# EAGLE design schematicmrpRevG (EAGLE 7.5.0)
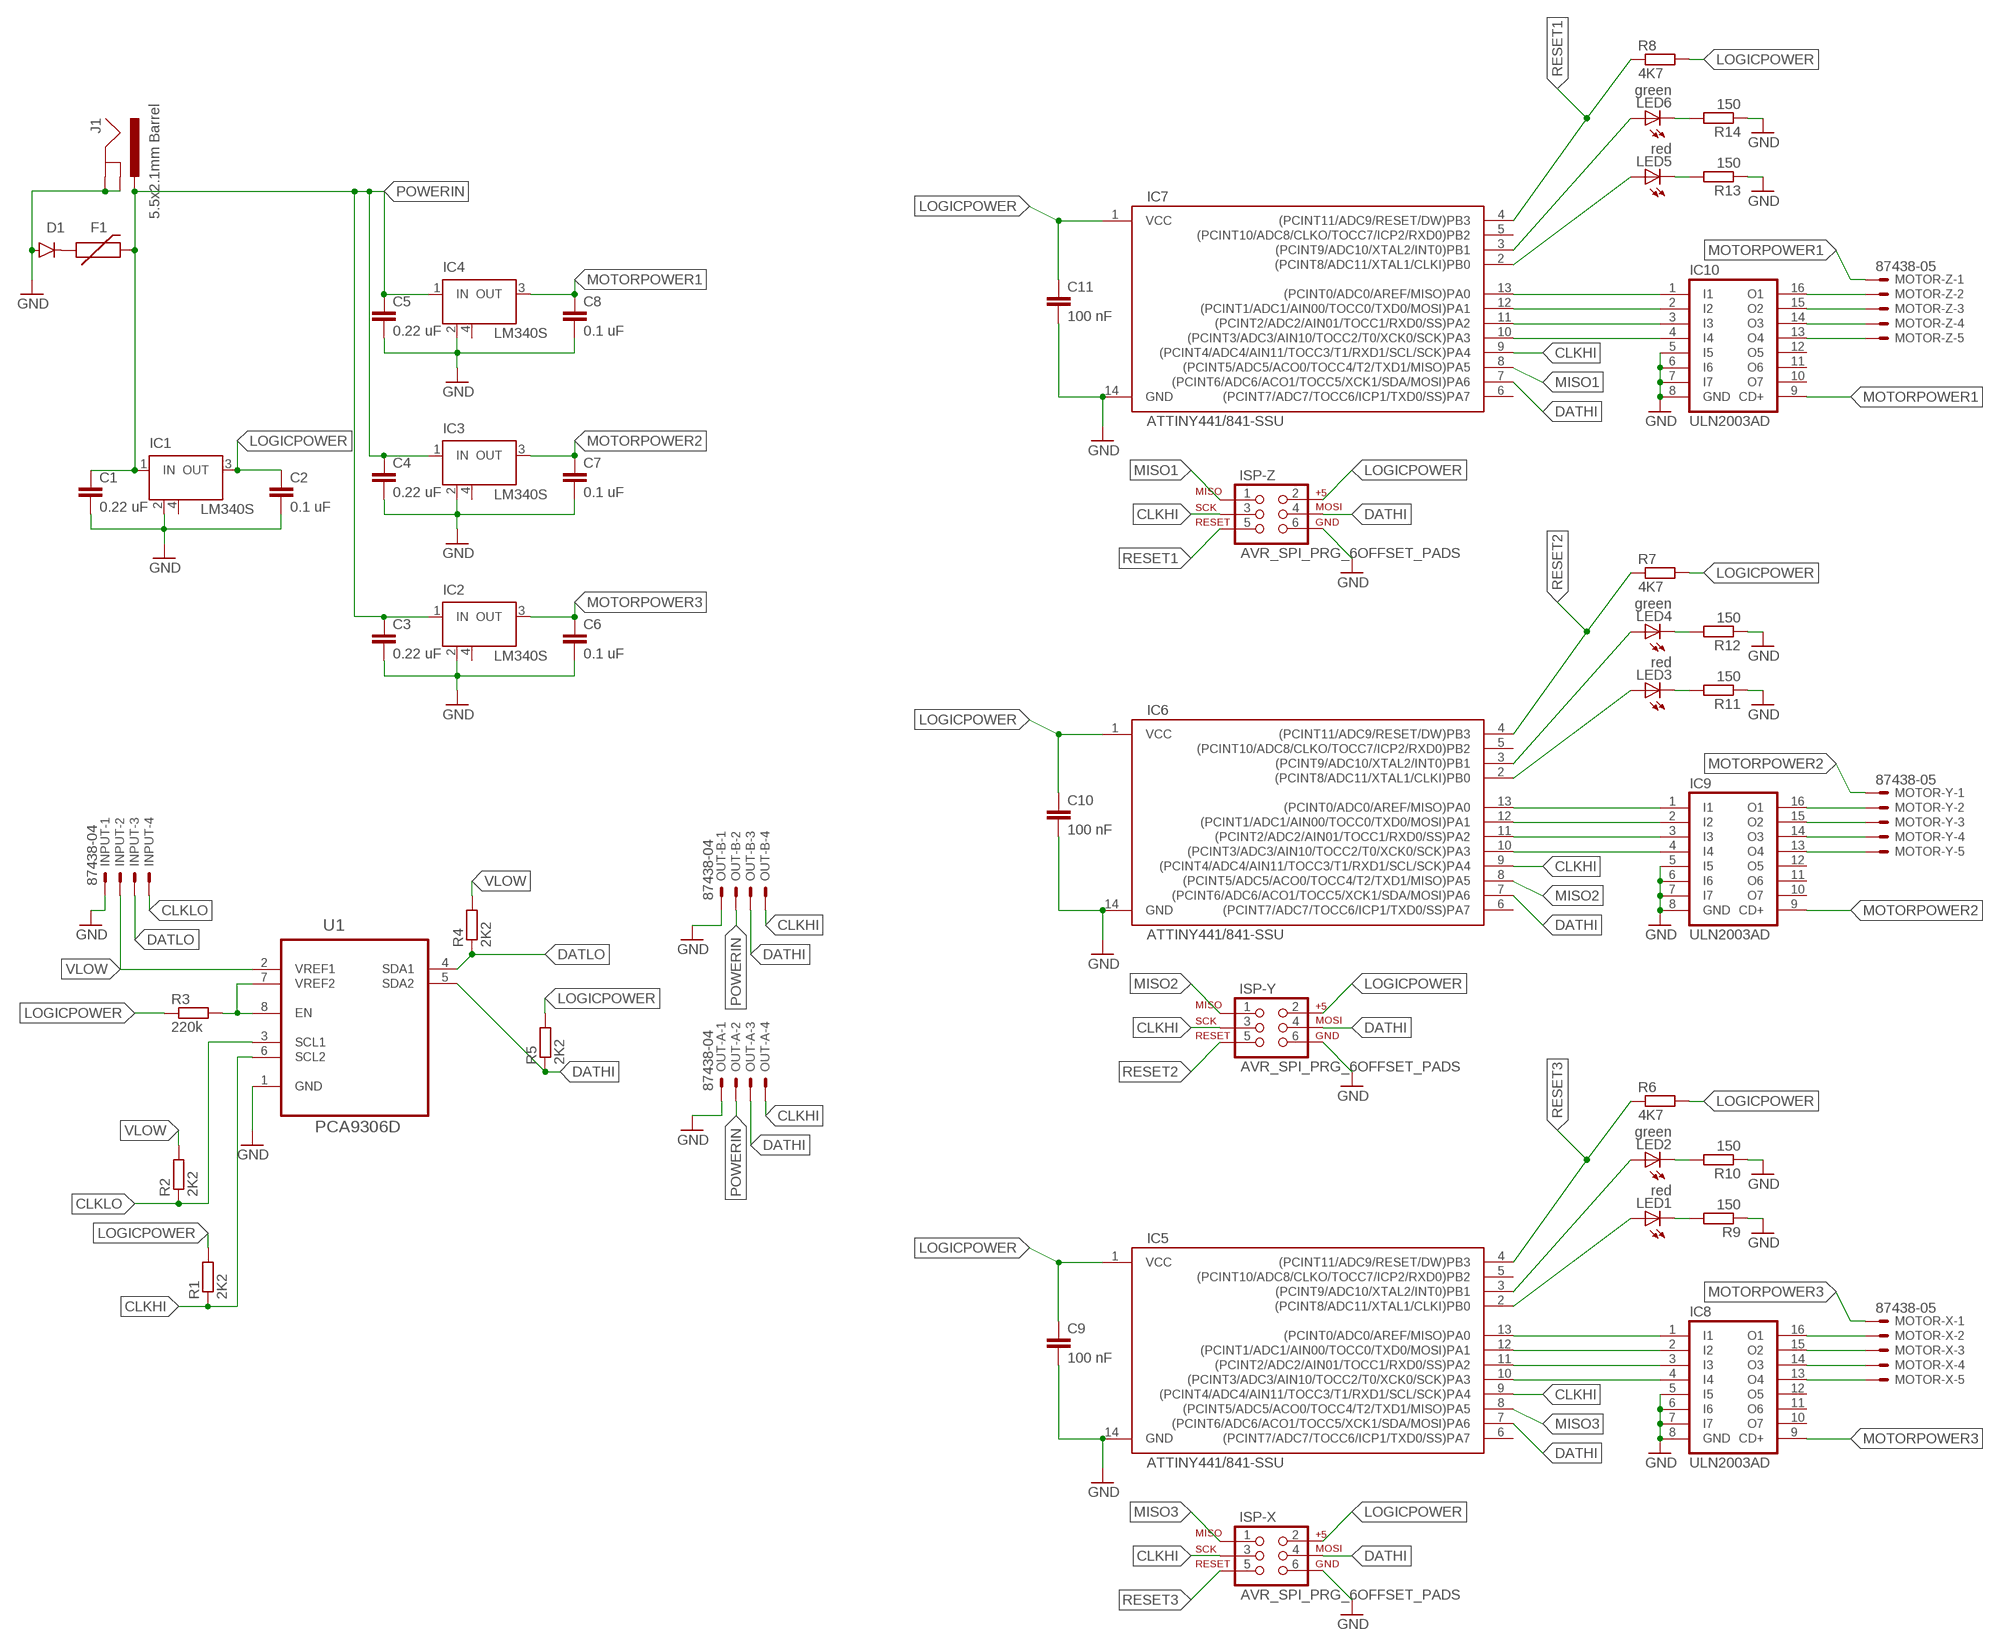
[diagram p0: schematic, sheet 1]

## Parts
C1  0.22 uF  CAP0805  [0805]
C2  0.1 uF  CAP0805  [0805]
C3  0.22 uF  CAP0805  [0805]
C4  0.22 uF  CAP0805  [0805]
C5  0.22 uF  CAP0805  [0805]
C6  0.1 uF  CAP0805  [0805]
C7  0.1 uF  CAP0805  [0805]
C8  0.1 uF  CAP0805  [0805]
C9  100 nF  CAP0805  [0805]
C10  100 nF  CAP0805  [0805]
C11  100 nF  CAP0805  [0805]
D1  3A/600V  DIODESMA-KIT  [SMA-DIODE-KIT]
F1  PTCSMD  [PTC-1206]
IC1  LM340S  [SOT223]
IC2  LM340S  [SOT223]
IC3  LM340S  [SOT223]
IC4  LM340S  [SOT223]
IC5  ATTINY441/841-SSU  [SOIC14N]
IC6  ATTINY441/841-SSU  [SOIC14N]
IC7  ATTINY441/841-SSU  [SOIC14N]
IC8  ULN2003AD  [SO16]
IC9  ULN2003AD  [SO16]
IC10  ULN2003AD  [SO16]
INPUT  87438-04  [87438-04]
ISP-X  AVR_SPI_PRG_6OFFSET_PADS  [2X3_OFFSET]
ISP-Y  AVR_SPI_PRG_6OFFSET_PADS  [2X3_OFFSET]
ISP-Z  AVR_SPI_PRG_6OFFSET_PADS  [2X3_OFFSET]
J1  5.5x2.1mm Barrel  POWER_JACKSMD  [POWER_JACK_SMD]
LED1  red  LEDCHIPLED_0805  [CHIPLED_0805]
LED2  green  LEDCHIPLED_0805  [CHIPLED_0805]
LED3  red  LEDCHIPLED_0805  [CHIPLED_0805]
LED4  green  LEDCHIPLED_0805  [CHIPLED_0805]
LED5  red  LEDCHIPLED_0805  [CHIPLED_0805]
LED6  green  LEDCHIPLED_0805  [CHIPLED_0805]
MOTOR-X  87438-05  [87438-05]
MOTOR-Y  87438-05  [87438-05]
MOTOR-Z  87438-05  [87438-05]
OUT-A  87438-04  [87438-04]
OUT-B  87438-04  [87438-04]
R1  2K2  R-EU_M0805  [M0805]
R2  2K2  R-EU_M0805  [M0805]
R3  220k  R-EU_M0805  [M0805]
R4  2K2  R-EU_M0805  [M0805]
R5  2K2  R-EU_M0805  [M0805]
R6  4K7  R-EU_M0805  [M0805]
R7  4K7  R-EU_M0805  [M0805]
R8  4K7  R-EU_M0805  [M0805]
R9  150  R-EU_M0805  [M0805]
R10  150  R-EU_M0805  [M0805]
R11  150  R-EU_M0805  [M0805]
R12  150  R-EU_M0805  [M0805]
R13  150  R-EU_M0805  [M0805]
R14  150  R-EU_M0805  [M0805]
U1  PCA9306D  [SOIC127P600X175-8N]

## Nets
CLKHI: IC5.9((PCINT4/ADC4/AIN11/TOCC3/T1/RXD1/SCL/SCK)PA4) IC6.9((PCINT4/ADC4/AIN11/TOCC3/T1/RXD1/SCL/SCK)PA4) IC7.9((PCINT4/ADC4/AIN11/TOCC3/T1/RXD1/SCL/SCK)PA4) ISP-X.3 ISP-Y.3 ISP-Z.3 OUT-A.4 OUT-B.4 R1.1 U1.6(SCL2)
CLKLO: INPUT.4 R2.1 U1.3(SCL1)
DATHI: IC5.7((PCINT6/ADC6/ACO1/TOCC5/XCK1/SDA/MOSI)PA6) IC6.7((PCINT6/ADC6/ACO1/TOCC5/XCK1/SDA/MOSI)PA6) IC7.7((PCINT6/ADC6/ACO1/TOCC5/XCK1/SDA/MOSI)PA6) ISP-X.4 ISP-Y.4 ISP-Z.4 OUT-A.3 OUT-B.3 R5.1 U1.5(SDA2)
DATLO: INPUT.3 R4.1 U1.4(SDA1)
GND: C1.2 C2.2 C3.2 C4.2 C5.2 C6.2 C7.2 C8.2 C9.2 C10.2 C11.2 D1.A IC1.2(GND) IC2.2(GND) IC3.2(GND) IC4.2(GND) IC5.14(GND) IC6.14(GND) IC7.14(GND) IC8.5(I5) IC8.6(I6) IC8.7(I7) IC8.8(GND) IC9.5(I5) IC9.6(I6) IC9.7(I7) IC9.8(GND) IC10.5(I5) IC10.6(I6) IC10.7(I7) IC10.8(GND) INPUT.1 ISP-X.6 ISP-Y.6 ISP-Z.6 J1.GND(GNDBREAK) J1.P$4(GND) OUT-A.1 OUT-B.1 R9.1 R10.1 R11.1 R12.1 R13.1 R14.1 U1.1(GND)
LOGICPOWER: C2.1 C9.1 C10.1 C11.1 IC1.3(OUT) IC5.1(VCC) IC6.1(VCC) IC7.1(VCC) ISP-X.2 ISP-Y.2 ISP-Z.2 R1.2 R3.1 R5.2 R6.2 R7.2 R8.2
MISO1: IC7.8((PCINT5/ADC5/ACO0/TOCC4/T2/TXD1/MISO)PA5) ISP-Z.1
MISO2: IC6.8((PCINT5/ADC5/ACO0/TOCC4/T2/TXD1/MISO)PA5) ISP-Y.1
MISO3: IC5.8((PCINT5/ADC5/ACO0/TOCC4/T2/TXD1/MISO)PA5) ISP-X.1
MOTORPOWER1: C8.1 IC4.3(OUT) IC10.9(CD+) MOTOR-Z.1
MOTORPOWER2: C7.1 IC3.3(OUT) IC9.9(CD+) MOTOR-Y.1
MOTORPOWER3: C6.1 IC2.3(OUT) IC8.9(CD+) MOTOR-X.1
N$1: LED4.C R12.2
N$2: LED3.C R11.2
N$3: R3.2 U1.7(VREF2) U1.8(EN)
N$4: IC10.16(O1) MOTOR-Z.2
N$5: IC10.15(O2) MOTOR-Z.3
N$6: LED6.C R14.2
N$7: LED5.C R13.2
N$8: IC10.14(O3) MOTOR-Z.4
N$9: IC10.13(O4) MOTOR-Z.5
N$10: IC7.13((PCINT0/ADC0/AREF/MISO)PA0) IC10.1(I1)
N$11: IC7.12((PCINT1/ADC1/AIN00/TOCC0/TXD0/MOSI)PA1) IC10.2(I2)
N$12: IC7.11((PCINT2/ADC2/AIN01/TOCC1/RXD0/SS)PA2) IC10.3(I3)
N$13: IC7.10((PCINT3/ADC3/AIN10/TOCC2/T0/XCK0/SCK)PA3) IC10.4(I4)
N$14: IC7.3((PCINT9/ADC10/XTAL2/INT0)PB1) LED6.A
N$15: IC7.2((PCINT8/ADC11/XTAL1/CLKI)PB0) LED5.A
N$16: IC9.16(O1) MOTOR-Y.2
N$17: IC9.15(O2) MOTOR-Y.3
N$18: IC9.14(O3) MOTOR-Y.4
N$19: IC9.13(O4) MOTOR-Y.5
N$20: IC6.13((PCINT0/ADC0/AREF/MISO)PA0) IC9.1(I1)
N$21: IC6.12((PCINT1/ADC1/AIN00/TOCC0/TXD0/MOSI)PA1) IC9.2(I2)
N$22: IC6.11((PCINT2/ADC2/AIN01/TOCC1/RXD0/SS)PA2) IC9.3(I3)
N$23: IC6.10((PCINT3/ADC3/AIN10/TOCC2/T0/XCK0/SCK)PA3) IC9.4(I4)
N$24: IC6.3((PCINT9/ADC10/XTAL2/INT0)PB1) LED4.A
N$25: IC6.2((PCINT8/ADC11/XTAL1/CLKI)PB0) LED3.A
N$26: LED2.C R10.2
N$27: LED1.C R9.2
N$28: IC8.16(O1) MOTOR-X.2
N$29: IC8.15(O2) MOTOR-X.3
N$30: IC8.14(O3) MOTOR-X.4
N$31: IC8.13(O4) MOTOR-X.5
N$32: IC5.13((PCINT0/ADC0/AREF/MISO)PA0) IC8.1(I1)
N$33: IC5.12((PCINT1/ADC1/AIN00/TOCC0/TXD0/MOSI)PA1) IC8.2(I2)
N$34: IC5.11((PCINT2/ADC2/AIN01/TOCC1/RXD0/SS)PA2) IC8.3(I3)
N$35: IC5.10((PCINT3/ADC3/AIN10/TOCC2/T0/XCK0/SCK)PA3) IC8.4(I4)
N$36: IC5.3((PCINT9/ADC10/XTAL2/INT0)PB1) LED2.A
N$37: IC5.2((PCINT8/ADC11/XTAL1/CLKI)PB0) LED1.A
N$38: D1.C F1.1
POWERIN [Power]: C1.1 C3.1 C4.1 C5.1 F1.2 IC1.1(IN) IC2.1(IN) IC3.1(IN) IC4.1(IN) J1.VIN0(PWR) OUT-A.2 OUT-B.2
RESET1: IC7.4((PCINT11/ADC9/RESET/DW)PB3) ISP-Z.5 R8.1
RESET2: IC6.4((PCINT11/ADC9/RESET/DW)PB3) ISP-Y.5 R7.1
RESET3: IC5.4((PCINT11/ADC9/RESET/DW)PB3) ISP-X.5 R6.1
VLOW: INPUT.2 R2.2 R4.2 U1.2(VREF1)
Unconnected: IC5.5((PCINT10/ADC8/CLKO/TOCC7/ICP2/RXD0)PB2) IC5.6((PCINT7/ADC7/TOCC6/ICP1/TXD0/SS)PA7) IC6.5((PCINT10/ADC8/CLKO/TOCC7/ICP2/RXD0)PB2) IC6.6((PCINT7/ADC7/TOCC6/ICP1/TXD0/SS)PA7) IC7.5((PCINT10/ADC8/CLKO/TOCC7/ICP2/RXD0)PB2) IC7.6((PCINT7/ADC7/TOCC6/ICP1/TXD0/SS)PA7) IC8.10(O7) IC8.11(O6) IC8.12(O5) IC9.10(O7) IC9.11(O6) IC9.12(O5) IC10.10(O7) IC10.11(O6) IC10.12(O5)

## Power pins joined to a net without a drawn wire
GND: IC1.4(GND) IC2.4(GND) IC3.4(GND) IC4.4(GND)

## Library data of the parts
C1 C3-C5 = SparkFun-Capacitors:CAP: Capacitor Standard 0603 ceramic capacitor, and 0.1" leaded capacitor.; MF: WALSIN; MPN: 0805B224K500CT; OC_FARNELL: 2496964
C2 C6-C8 = SparkFun-Capacitors:CAP: Capacitor Standard 0603 ceramic capacitor, and 0.1" leaded capacitor.; MF: AVX; MPN: 08055C104KAT2A; OC_FARNELL: 499687
C9-C11 = SparkFun-Capacitors:CAP: Capacitor Standard 0603 ceramic capacitor, and 0.1" leaded capacitor.; MF: AVX; MPN: 08055F104KAT2A; OC_FARNELL: 1301790
D1 = SparkFun-DiscreteSemi:DIODE: Diode These are standard reverse protection diodes and small signal diodes. SMA package can handle up to about 1A. SOD-323 can handle about 200mA. What the SOD-323 package when ordering, there are some mfgs out there that are 5-pin packages.; MF: BOURNS; MPN: CD214A-B140LF; OC_FARNELL: 1612331
F1 = SparkFun-PowerIC:PTC: Resettable Fuse PTC Resettable Fuse. Spark Fun Electronics SKU : COM-08357; MF: TE CONNECTIVITY / RAYCHEM; MPN: NANOSMDC012F-2; OC_FARNELL: 1345937; PROD_ID: RES-11150
IC1-IC4 = linear:LM340S: 3-Terminal Positive Regulators Source: http://cache.national.com/ds/LM/LM340.pdf; MF: TEXAS INSTRUMENTS; MPN: LM340MP-5.0/NOPB; OC_FARNELL: 1469097
IC5-IC7 = bt_avr:ATTINY441/841: ATtiny441, ATtiny841 AVR Microcontroller The high-performance Atmel picoPower 8-bit AVR RISC-based microcontroller combines 4KB ISP flash memory, 512-Byte EEPROM, 128B SRAM, 12 general purpose I/O lines, 32 general purpose working registers, an 8-bit timer/counter with two PWM channels, two 16-bit timer/counters with two PWM channels, internal and external interrupts, an 12-channel 10-bit A/D converter, 2 On-chip analog comparators, 2 full duplex USARTs with Start Frame wake up from power down, master/slave SPI serial interface, slave I2C serial interface, programmable gain stage (1x, 20x, and 100x) for 12 differential ADC channel pairs, programmable watchdog timer with internal oscillator, internal calibrated oscillator, and four software selectable power saving modes. The device operates between 1.7-5.5 volts. datasheet.pdf <http://www.atmel.com/Images/Atmel-8495-8-bit-AVR-Microcontrollers-ATtiny441-ATtiny841_Datasheet.pdf>; MF: ATMEL; MPN: ATTINY841-SSU; OC_FARNELL: 2396716
IC8-IC10 = uln-udn:ULN2003A: DRIVER ARRAY; MF: TEXAS INSTRUMENTS; MPN: ULN2003ADR; OC_FARNELL: 1470513
INPUT OUT-A OUT-B = con-molex:87438-04: Wire-to-Board 1.50mm (.059") Pitch Header - Right Angle, SMT, Shrouded Source: http://www.molex.com/product/micro/87438.html; MF: MOLEX; MPN: 87438-0443; OC_FARNELL: 1711329; OC_NEWARK: unknown
ISP-X ISP-Y ISP-Z = SparkFun-Connectors:AVR_SPI_PRG_6: AVR ISP 6 Pin This is the reduced ISP connector for AVR programming. Common on Arduino. This footprint will take up less PCB space and can be used with a 10-pin to 6-pin adapter such as SKU: BOB-08508 **Special note about "TEST_POINT" package. The stop mask is on the top side, so if you want your programming test points to be on the bottom of your board, make sure to place this package on the bottom side of the board. This also ensure that the orientation to program from the bottom side will be correct.; MF: GLOBAL CONNECTOR TECHNOLOGY; MPN: BG050-06A-0-0450-0737-0350-L-D; OC_FARNELL: 1798973
J1 = SparkFun-Connectors:POWER_JACK: Power Jack This is the standard 5.5mm barrel jack for power. The PTH is the most common, proven, reliable, footprint. The Slot footprint only works if the mill layer is transmitted to the PCB fab house so be warned. Mating wall wart : TOL-00298 (and others); MF: CLIFF ELECTRONIC COMPONENTS; MPN: FC68148S; OC_FARNELL: 1889309; PROD_ID: CONN-08106; SF_ID: PRT-12748
LED1 LED3 LED5 = led:LED: LED OSRAM: - CHIPLED LG R971, LG N971, LY N971, LG Q971, LY Q971, LO R971, LY R971 LH N974, LH R974 LS Q976, LO Q976, LY Q976 LO Q996 - Hyper CHIPLED LW Q18S LB Q993, LB Q99A, LB R99A - SideLED LS A670, LO A670, LY A670, LG A670, LP A670 LB A673, LV A673, LT A673, LW A673 LH A674 LY A675 LS A676, LA A676, LO A676, LY A676, LW A676 LS A679, LY A679, LG A679 - Hyper Micro SIDELED® LS Y876, LA Y876, LO Y876, LY Y876 LT Y87S - SmartLED LW L88C, LW L88S LB L89C, LB L89S, LG L890 LS L89K, LO L89K, LY L89K LS L896, LA L896, LO L896, LY L896 - TOPLED LS T670, LO T670, LY T670, LG T670, LP T670 LSG T670, LSP T670, LSY T670, LOP T670, LYG T670 LG T671, LOG T671, LSG T671 LB T673, LV T673, LT T673, LW T673 LH T674 LS T676, LA T676, LO T676, LY T676, LB T676, LH T676, LSB T676, LW T676 LB T67C, LV T67C, LT T67C, LS T67K, LO T67K, LY T67K, LW E67C LS E67B, LA E67B, LO E67B, LY E67B, LB E67C, LV E67C, LT E67C LW T67C LS T679, LY T679, LG T679 LS T770, LO T770, LY T770, LG T770, LP T770 LB T773, LV T773, LT T773, LW T773 LH T774 LS E675, LA E675, LY E675, LS T675 LS T776, LA T776, LO T776, LY T776, LB T776 LHGB T686 LT T68C, LB T68C - Hyper Mini TOPLED® LB M676 - Mini TOPLED Santana® LG M470 LS M47K, LO M47K, LY M47K Source: http://www.osram.convergy.de LUXEON: - LUMILED® LXK2-PW12-R00, LXK2-PW12-S00, LXK2-PW14-U00, LXK2-PW14-V00 LXK2-PM12-R00, LXK2-PM12-S00, LXK2-PM14-U00 LXK2-PE12-Q00, LXK2-PE12-R00, LXK2-PE12-S00, LXK2-PE14-T00, LXK2-PE14-U00 LXK2-PB12-K00, LXK2-PB12-L00, LXK2-PB12-M00, LXK2-PB14-N00, LXK2-PB14-P00, LXK2-PB14-Q00 LXK2-PR12-L00, LXK2-PR12-M00, LXK2-PR14-Q00, LXK2-PR14-R00 LXK2-PD12-Q00, LXK2-PD12-R00, LXK2-PD12-S00 LXK2-PH12-R00, LXK2-PH12-S00 LXK2-PL12-P00, LXK2-PL12-Q00, LXK2-PL12-R00 Source: www.luxeon.com KINGBRIGHT: KA-3528ASYC Source: www.kingbright.com; MF: OSRAM; MPN: LSR976; OC_FARNELL: 1226392
LED2 LED4 LED6 = led:LED: LED OSRAM: - CHIPLED LG R971, LG N971, LY N971, LG Q971, LY Q971, LO R971, LY R971 LH N974, LH R974 LS Q976, LO Q976, LY Q976 LO Q996 - Hyper CHIPLED LW Q18S LB Q993, LB Q99A, LB R99A - SideLED LS A670, LO A670, LY A670, LG A670, LP A670 LB A673, LV A673, LT A673, LW A673 LH A674 LY A675 LS A676, LA A676, LO A676, LY A676, LW A676 LS A679, LY A679, LG A679 - Hyper Micro SIDELED® LS Y876, LA Y876, LO Y876, LY Y876 LT Y87S - SmartLED LW L88C, LW L88S LB L89C, LB L89S, LG L890 LS L89K, LO L89K, LY L89K LS L896, LA L896, LO L896, LY L896 - TOPLED LS T670, LO T670, LY T670, LG T670, LP T670 LSG T670, LSP T670, LSY T670, LOP T670, LYG T670 LG T671, LOG T671, LSG T671 LB T673, LV T673, LT T673, LW T673 LH T674 LS T676, LA T676, LO T676, LY T676, LB T676, LH T676, LSB T676, LW T676 LB T67C, LV T67C, LT T67C, LS T67K, LO T67K, LY T67K, LW E67C LS E67B, LA E67B, LO E67B, LY E67B, LB E67C, LV E67C, LT E67C LW T67C LS T679, LY T679, LG T679 LS T770, LO T770, LY T770, LG T770, LP T770 LB T773, LV T773, LT T773, LW T773 LH T774 LS E675, LA E675, LY E675, LS T675 LS T776, LA T776, LO T776, LY T776, LB T776 LHGB T686 LT T68C, LB T68C - Hyper Mini TOPLED® LB M676 - Mini TOPLED Santana® LG M470 LS M47K, LO M47K, LY M47K Source: http://www.osram.convergy.de LUXEON: - LUMILED® LXK2-PW12-R00, LXK2-PW12-S00, LXK2-PW14-U00, LXK2-PW14-V00 LXK2-PM12-R00, LXK2-PM12-S00, LXK2-PM14-U00 LXK2-PE12-Q00, LXK2-PE12-R00, LXK2-PE12-S00, LXK2-PE14-T00, LXK2-PE14-U00 LXK2-PB12-K00, LXK2-PB12-L00, LXK2-PB12-M00, LXK2-PB14-N00, LXK2-PB14-P00, LXK2-PB14-Q00 LXK2-PR12-L00, LXK2-PR12-M00, LXK2-PR14-Q00, LXK2-PR14-R00 LXK2-PD12-Q00, LXK2-PD12-R00, LXK2-PD12-S00 LXK2-PH12-R00, LXK2-PH12-S00 LXK2-PL12-P00, LXK2-PL12-Q00, LXK2-PL12-R00 Source: www.luxeon.com KINGBRIGHT: KA-3528ASYC Source: www.kingbright.com; MF: DIALIGHT; MPN: 5988170107F; OC_FARNELL: 1465996
MOTOR-X MOTOR-Y MOTOR-Z = con-molex:87438-05: Wire-to-Board 1.50mm (.059") Pitch Header - Right Angle, SMT, Shrouded Source: http://www.molex.com/product/micro/87438.html; MF: MOLEX; MPN: 87438-0543; OC_FARNELL: 1711330; OC_NEWARK: 94M1090
R1 R2 R4 R5 = resistor:R-EU_: RESISTOR, European symbol; MF: PANASONIC ELECTRONIC COMPONENTS; MPN: ERA6AEB222V; OC_FARNELL: 1577663
R3 = resistor:R-EU_: RESISTOR, European symbol; MF: WELWYN; MPN: WCR0805-220KFI; OC_FARNELL: 1099818
R6-R8 = resistor:R-EU_: RESISTOR, European symbol; MF: WELWYN; MPN: WCR0805-4K7FI; OC_FARNELL: 1099805
R9-R14 = resistor:R-EU_: RESISTOR, European symbol; MF: WELWYN; MPN: WCR0805-150RFI; OC_FARNELL: 1099794
U1 = i2c:PCA9306D: IC, I2C/SMBUS VOLT TRANS DUAL, SOIC-8; MF: NXP; MPN: PCA9306D; OC_FARNELL: 2212070; OC_NEWARK: 55W4294; PACKAGE: SOIC-8; SUPPLIER: NXP

## Net classes
0 default: width 0.254 mm
1 Power: width 0.762 mm

## Board
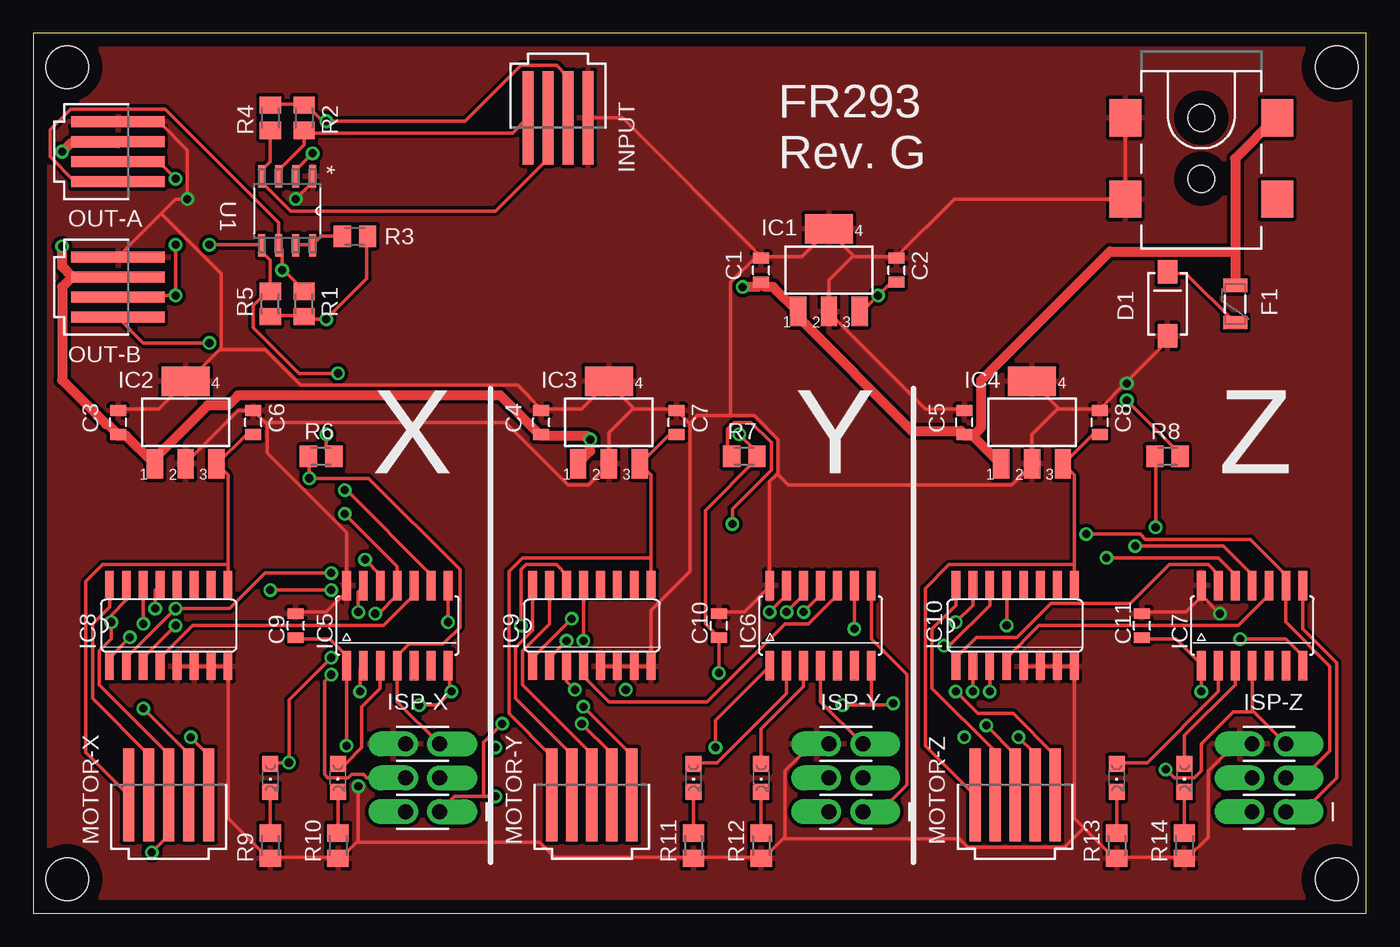
[diagram p1: board, top side]
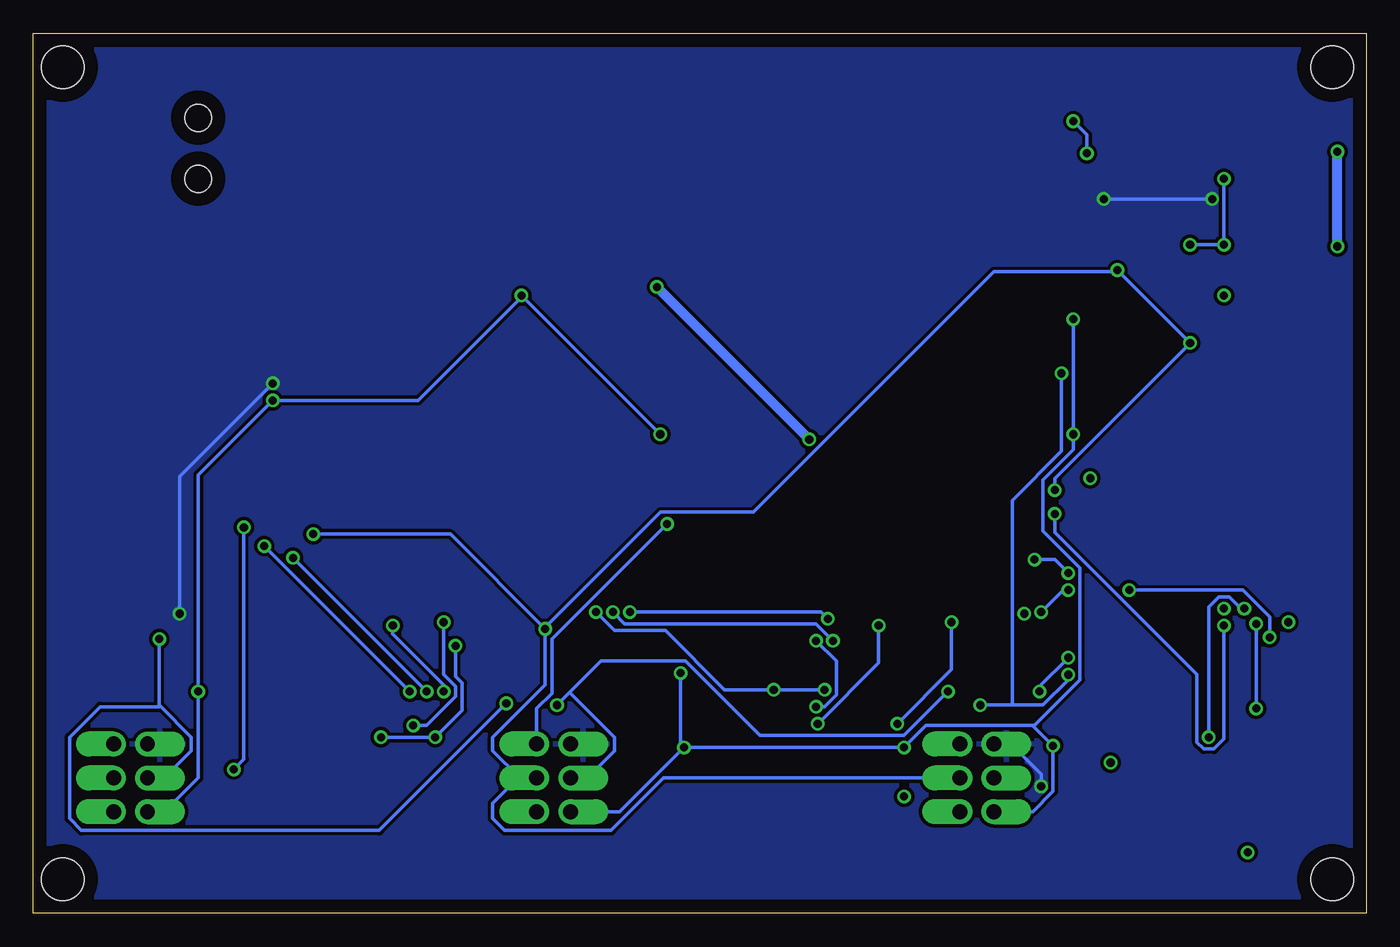
[diagram p2: board, bottom side, seen from below]

Size 100 x 66.03 mm. Coordinates in mm from the lower left corner, seen from the top.
Outline: 0,0 100,0 100,66.03 0,66.03 0,0
Copper layers (1*16): Top 0.035mm / dielectric 1.5mm / Bottom 0.035mm
Design rules "default *": minimum track width 10mil, minimum drill 24mil, track to track 10mil, track to pad 10mil, pad to pad 10mil, via to via 10mil, smd to smd 8mil, copper to edge 40mil, drill to drill 8mil, minimum pad ring 10mil, minimum via ring 8mil, stop-mask expansion 4mil, vias tented up to drill 0mil, thermal gap 10mil
Holes 3.2 mm at 2.54,63.5 97.79,63.5 97.79,2.54 2.54,2.54

### Footprints (pad centres in the part's own frame; a part is rotated, then mirrored left to right if it is on the bottom)
0805 = smd 0.8 x 1.2: 1 -0.9,0; 2 0.9,0
SMA-DIODE-KIT = smd 1.77 x 1.47: A -2.4,0; C 2.4,0
PTC-1206 = smd 1 x 1.8: 1 -1.4,0; 2 1.4,0
SOT223 = smd 1.219 x 2.235: 1 -2.311,-3.099; 2 0,-3.099; 3 2.311,-3.099 | smd 3.6 x 2.2: 4 0,3.099
SOIC14N = smd 0.66 x 2.2: 1 -3.81,-3; 2 -2.54,-3; 3 -1.27,-3; 4 0,-3; 5 1.27,-3; 6 2.54,-3; 7 3.81,-3; 8 3.81,3; 9 2.54,3; 10 1.27,3; 11 0,3; 12 -1.27,3; 13 -2.54,3; 14 -3.81,3
SO16 = smd 0.66 x 2.032: 1 -4.445,-3.073; 2 -3.175,-3.073; 3 -1.905,-3.073; 4 -0.635,-3.073; 5 0.635,-3.073; 6 1.905,-3.073; 7 3.175,-3.073; 8 4.445,-3.073; 9 4.445,3.073; 10 3.175,3.073; 11 1.905,3.073; 12 0.635,3.073; 13 -0.635,3.073; 14 -1.905,3.073; 15 -3.175,3.073; 16 -4.445,3.073
87438-04 = smd 7 x 0.85: 1 0,2.25; 2 0,0.75; 3 0,-0.75; 4 0,-2.25
2X3_OFFSET = drill 1.118 pad 1.88 offset: 1 -2.54,-1.27; 2 -2.54,1.27; 3 0,-1.27; 4 0,1.27; 5 2.54,-1.27; 6 2.54,1.27
POWER_JACK_SMD = smd 2.8 x 2.4: GND 0,-5.7; P$4 6.1,-5.7; VIN0 0,5.7; VIN1 6.1,5.7 | hole 2.032: 0,0; 4.572,0
CHIPLED_0805 = smd 1.2 x 1.2: A 0,-1.05; C 0,1.05
87438-05 = smd 7 x 0.85: 1 0,3; 2 0,1.5; 3 0,0; 4 0,-1.5; 5 0,-3
M0805 = smd 1.3 x 1.6: 1 -0.95,0; 2 0.95,0
SOIC127P600X175-8N = smd 1.702 x 0.533: 1 -2.591,1.905; 2 -2.591,0.635; 3 -2.591,-0.635; 4 -2.591,-1.905; 5 2.591,-1.905; 6 2.591,-0.635; 7 2.591,0.635; 8 2.591,1.905

### Placement (x,y rotation side)
C1  54.61,48.26 90 top
C2  64.77,48.26 90 top
C3  6.35,36.83 90 top
C4  38.1,36.83 90 top
C5  69.85,36.83 90 top
C6  16.51,36.83 90 top
C7  48.26,36.83 90 top
C8  80.01,36.83 90 top
C9  19.68,21.59 90 top
C10  51.44,21.59 90 top
C11  83.19,21.59 90 top
D1  85.09,45.72 90 top
F1  90.17,45.72 90 top
IC1  59.69,48.26 0 top
IC2  11.43,36.83 0 top
IC3  43.18,36.83 0 top
IC4  74.93,36.83 0 top
IC5  27.3,21.59 0 top
IC6  59.05,21.59 0 top
IC7  91.44,21.59 0 top
IC8  10.16,21.59 0 top
IC9  41.91,21.59 0 top
IC10  73.66,21.59 0 top
INPUT  39.37,59.69 270 top
ISP-X  29.21,10.16 90 top
ISP-Y  60.96,10.16 90 top
ISP-Z  92.71,10.16 90 top
J1  87.63,59.69 270 top
LED1  17.78,10.16 180 top
LED2  22.86,10.16 180 top
LED3  49.53,10.16 180 top
LED4  54.61,10.16 180 top
LED5  81.28,10.16 180 top
LED6  86.36,10.16 180 top
MOTOR-X  10.16,8.89 90 top
MOTOR-Y  41.91,8.89 90 top
MOTOR-Z  73.66,8.89 90 top
OUT-A  6.35,57.15 0 top
OUT-B  6.35,46.99 0 top
R1  20.32,45.72 270 top
R2  20.32,59.69 90 top
R3  24.13,50.8 180 top
R4  17.78,59.69 90 top
R5  17.78,45.72 270 top
R6  21.59,34.29 0 top
R7  53.34,34.29 0 top
R8  85.09,34.29 0 top
R9  17.78,5.08 90 top
R10  22.86,5.08 90 top
R11  49.53,5.08 90 top
R12  54.61,5.08 90 top
R13  81.28,5.08 90 top
R14  86.36,5.08 90 top
U1  19.05,52.7 270 top

### Tracks (layer width: path | path; a pad name or v marks a point on that pad's centre or on a via)
CLKHI  (via drill 0.61)
  Top 0.254: 18.67,48.39 18.67,49.78 18.41,50.04 U1.6 18.41,51.82 9.91,60.33 2.79,60.33 1.27,58.8 1.27,56.77 3.05,54.99 6.35,54.99 OUT-A.4 | 18.67,48.39 20.32,46.74 R1.1 | 18.67,48.39 v18.67,48.26 | v13.21,42.8 8.26,42.8 6.35,44.7 OUT-B.4 | IC5.9 29.84,25.4 23.5,31.75 v23.37,31.75 | ISP-Z.3 95.25,10.16 97.28,12.19 97.28,18.54 93.98,21.84 IC7.9 93.98,25.4 91.31,28.07 83.44,28.07 83.06,28.45 v78.99,28.45 | IC6.9 v61.59,21.34
  Bottom 0.254: v23.37,31.75 23.37,32.64 v13.21,42.8 v18.67,48.26 18.67,48.13 27.94,48.13 45.97,30.1 52.96,30.1 61.59,21.46 v61.59,21.34 | v61.59,21.34 61.59,17.14 65.53,13.21 65.53,12.19 63.5,10.16 ISP-Y.3 63.63,10.16 65.53,8.26 65.53,7.11 64.64,6.22 56.64,6.22 52.7,10.16 ISP-X.3 | v78.99,28.45 68.71,28.45 v61.59,21.34
CLKLO
  Top 0.254: 20.32,58.55 20.32,57.66 18.41,55.75 U1.3 | 20.32,58.55 R2.1 20.32,58.67 | 20.32,58.55 35.94,58.55 37.08,59.69 INPUT.4
DATHI  (via drill 0.61)
  Top 0.254: v10.67,50.16 v10.67,46.35 6.35,46.35 OUT-B.3 | v13.21,50.16 17.14,50.16 U1.5 17.14,49.66 17.78,49.02 R5.1 17.78,46.61 17.53,46.61 16.51,45.59 16.51,43.94 19.94,40.51 v22.86,40.51 | v10.67,55.12 9.4,56.39 6.35,56.39 OUT-A.3 | v90.55,20.57 93.98,20.57 95.25,19.3 IC7.7 | v28.96,15.62 30.35,15.62 v31.37,16.64 31.24,16.64 31.24,18.41 31.11,18.54 IC5.7 | 62.87,15.62 64.39,15.62 v64.52,15.75 | 62.87,15.62 v60.71,15.62 | IC6.7 62.87,15.62 | ISP-X.4 25.02,10.16 24.77,10.41 23.88,10.41 23.62,10.16 22.1,10.16 21.84,10.41 21.84,17.4 v22.35,17.91
  Bottom 0.254: v13.21,50.16 v10.67,50.16 v10.67,55.12 | v90.55,20.57 90.55,15.62 90.49,15.56 | 90.49,15.56 88.14,13.21 88.14,12.19 90.17,10.16 ISP-Z.4 | v31.37,16.64 34.67,13.34 45.47,13.34 51.05,18.92 57.4,18.92 59.75,16.57 | v60.71,15.62 59.75,16.57 | v22.35,17.91 22.35,17.53 24.26,15.62 26.54,15.62 | v28.96,15.62 26.54,15.62 | ISP-Y.4 58.42,10.16 56.39,12.19 56.39,13.21 59.75,16.57 | v64.52,15.75 74.04,6.22 96.39,6.22 97.28,7.11 97.28,13.21 95,15.49 90.55,15.49 90.49,15.56 | v22.86,40.51 22.86,34.67 26.54,30.99 26.54,15.62
DATLO
  Top 0.254: R4.1 17.78,56.39 17.14,55.75 U1.4 17.14,54.86 19.3,52.7 34.67,52.7 38.61,56.64 38.61,59.69 INPUT.3
GND  (via drill 0.61)
  Top 0.254: 22.86,4.19 17.78,4.19 | 12.06,18.54 10.79,18.54 IC8.5 | 12.06,18.54 13.34,18.54 | 12.06,18.54 IC8.6 | 13.34,18.54 14.61,18.54 IC8.8 14.61,7.11 17.53,4.19 17.78,4.19 | 13.34,18.54 IC8.7 | 17.78,4.19 R9.1 | v24.38,9.53 24.38,5.46 24.32,5.4 | 24.32,5.4 23.11,4.19 22.86,4.19 | 22.86,4.19 R10.1 | 54.61,4.19 49.53,4.19 | 54.61,4.19 54.86,4.19 56.33,5.65 | 56.33,5.65 56.39,5.71 56.39,10.67 58.42,12.7 ISP-Y.6 | 54.61,4.19 R12.1 | 75.56,18.54 74.3,18.54 IC10.5 | 75.56,18.54 76.83,18.54 | 75.56,18.54 IC10.6 | 76.83,18.54 78.11,18.54 IC10.8 78.11,7.11 78.8,6.41 | 76.83,18.54 IC10.7 | 86.36,4.19 81.28,4.19 | 86.36,4.19 86.61,4.19 88.14,5.71 88.14,10.67 90.17,12.7 ISP-Z.6 | 86.36,4.19 R14.1 | 78.8,6.41 81.03,4.19 81.28,4.19 | 81.28,4.19 R13.1 | 66.04,5.59 69.47,5.59 70.1,4.95 77.34,4.95 78.8,6.41 | 66.04,5.59 56.39,5.59 56.33,5.65 | 49.53,4.19 39.12,4.19 37.97,5.33 24.38,5.33 24.32,5.4 | 49.53,4.19 R11.1 | C5.2 69.85,37.85 66.93,37.85 59.69,45.09 IC1.2 59.69,47.5 61.53,49.34 | J1.GND 81.92,59.69 81.92,53.59 J1.P$4 81.79,53.59 69.09,53.59 64.77,49.28 | 54.61,49.28 57.66,49.28 59.69,51.31 IC1.4 59.69,51.18 61.53,49.34 | 64.77,49.28 61.59,49.28 61.53,49.34 | 64.77,49.28 C2.2 | INPUT.1 44.2,59.69 54.61,49.28 | 54.61,49.28 C1.2 54.36,49.4 52.32,47.37 52.32,37.34 | C3.2 6.35,37.85 9.4,37.85 11.43,39.88 IC2.4 11.43,40.01 11.68,40.01 14.03,42.35 | U1.1 20.95,54.86 v19.68,53.59 | 9.59,52.51 6.35,49.28 OUT-B.1 | 9.59,52.51 10.67,53.59 v11.56,53.59 11.56,57.28 9.53,59.31 6.35,59.31 OUT-A.1 | 14.03,42.35 14.1,42.42 14.1,48.01 9.59,52.51 | v89.03,22.48 87.63,23.88 IC7.14 87.63,23.75 86.49,22.61 83.19,22.61 C11.2 | 80.01,37.85 76.96,37.85 76.9,37.91
  Top 0.254: 76.9,37.91 74.93,39.88 IC4.4 | D1.A 85.09,42.93 81.98,39.81 | 80.01,37.85 81.98,39.81 | 80.01,37.85 C8.2 | 76.9,37.91 74.93,35.94 IC4.2 74.93,33.66 73.41,32.13 66.04,32.13 | v82.04,39.75 81.98,39.81 | C9.2 19.68,22.61 21.97,22.61 23.5,24.13 IC5.14 23.5,28.57 17.53,34.54 17.53,36.7 17.46,36.77 | C6.2 15.37,37.72 11.43,33.78 IC2.2 | C6.2 17.46,36.77 | C6.2 | C10.2 51.44,22.61 53.34,22.61 55.24,24.51 IC6.14 55.24,32.38 55.82,32.96 | 43.81,18.54 42.55,18.54 IC9.5 | 43.81,18.54 45.09,18.54 | 43.81,18.54 IC9.6 | 45.09,18.54 46.35,18.54 | 45.09,18.54 IC9.7 | 38.1,37.85 41.15,37.85 43.18,39.88 IC3.4 43.18,39.75 45.02,37.91 | 45.02,37.91 45.09,37.85 48.26,37.85 C7.2 49.21,36.77 | 45.02,37.91 43.18,36.07 IC3.2 43.18,33.66 41.66,32.13 40.13,32.13 35.43,36.83 17.53,36.83 17.46,36.77 | 46.35,18.54 46.35,22.73 49.28,25.65 49.28,36.7 49.21,36.77 | 46.35,18.54 IC9.8 | 55.82,32.96 55.88,33.02 55.88,35.56 54.1,37.34 52.32,37.34 | 52.32,37.34 49.78,37.34 49.21,36.77 | 66.04,32.13 56.64,32.13 55.82,32.96 | 38.1,37.85 36.32,39.62 20.07,39.62 17.4,42.29 14.1,42.29 14.03,42.35 | 38.1,37.85 C4.2 | 66.04,32.13 66.04,5.59
  Bottom 0.254: ISP-X.6 26.67,12.7 24.38,10.41 v24.38,9.53 | v11.56,53.59 v19.68,53.59 | v89.03,22.48 89.03,32.77 v82.04,39.75
  pour Top: 0,66.04 100.33,66.04 100.33,0 0,0
  pour Bottom: 0,0 0,66.04 100.33,66.04 100.33,0
LOGICPOWER  (via drill 0.61)
  Top 0.254: v87.63,16.64 IC7.1 87.63,18.67 85.72,20.57 83.19,20.57 C11.1 | v82.04,38.48 85.98,34.54 85.98,34.29 R8.2 | IC1.3 62.1,45.09 v63.37,46.35 64.26,47.24 64.77,47.24 C2.1 | v52.96,35.94 54.23,34.67 54.23,34.29 | 54.23,34.29 54.23,34.04 50.42,30.23 50.42,21.72 51.44,20.7 C10.1 v51.44,18.03 | 54.23,34.29 R7.2 | v21.97,35.94 21.97,34.8 22.48,34.29 R6.2 | R5.2 17.78,44.83 20.32,44.83 R1.2 20.32,44.7 20.45,44.58 v21.97,44.58 25.02,47.62 25.02,50.8 R3.1 | v51.18,12.45 51.18,14.48 55.24,18.54 IC6.1 | C9.1 19.68,20.57 22.23,20.57 23.5,19.3 IC5.1 v23.5,12.57
  Bottom 0.254: ISP-Z.2 90.17,7.62 87.63,10.16 v87.63,16.64 87.63,32.89 v82.04,38.48 71.12,38.48 63.37,46.23 v63.37,46.35 v52.96,35.94 | v21.97,44.58 v21.97,35.94 21.97,34.8 24.26,32.51 24.26,28.7 21.46,25.91 21.46,17.53 24.96,14.03 | ISP-Y.2 56.01,7.62 v51.18,12.45 | 24.96,14.03 v23.5,12.57 23.5,9.14 25.02,7.62 ISP-X.2 | 24.96,14.03 25.02,14.1 33.02,14.1 v34.67,12.45 v51.18,12.45 | v51.44,18.03 51.44,12.32 v51.18,12.45
MISO1
  Top 0.254: IC7.8 95.25,21.34 97.79,18.8 97.79,10.16 95.25,7.62 ISP-Z.1
MISO2
  Top 0.254: IC6.8 62.87,20.57 65.53,17.91 65.53,9.65 63.5,7.62 ISP-Y.1
MISO3  (via drill 0.61)
  Top 0.254: IC5.8 v31.11,21.84 | 33.78,8.76 31.62,8.76 ISP-X.1 | 33.78,8.76 v34.67,8.76 | v35.18,14.22 33.78,12.83 33.78,8.76
  Bottom 0.254: v31.11,21.84 31.11,18.29 v35.18,14.22
MOTORPOWER1
  Top 0.254: C8.1 80.01,35.81 79.38,35.81 77.34,33.78 IC4.3 77.34,33.66 78.11,32.89 78.11,26.16 | 78.11,26.16 IC10.9 | 78.11,26.16 68.71,26.16 66.93,24.38 66.93,12.57 70.61,8.89 MOTOR-Z.1
MOTORPOWER2
  Top 0.254: C7.1 48.26,35.81 47.62,35.81 45.59,33.78 IC3.3 45.59,33.66 46.35,32.89 46.35,26.67 | 46.35,26.67 IC9.9 | 46.35,26.67 36.7,26.67 35.69,25.65 35.69,14.99 38.86,11.81 38.86,8.89 MOTOR-Y.1
MOTORPOWER3
  Top 0.254: C6.1 16.51,35.81 15.88,35.81 13.84,33.78 IC2.3 13.84,33.66 14.61,32.89 14.61,26.16 | 14.61,26.16 IC8.9 | 14.61,26.16 5.21,26.16 3.94,24.89 3.94,12.06 7.11,8.89 MOTOR-X.1
N$1
  Top 0.254: R12.2 LED4.C
N$2
  Top 0.254: R11.2 LED3.C
N$3
  Top 0.254: R3.2 21.59,50.8 20.95,50.16 | 20.95,50.16 19.68,50.16 U1.7 | 20.95,50.16 U1.8
N$4
  Top 0.254: IC10.16 69.22,23.11 67.44,21.34 67.44,16.89 72.14,12.19 72.14,8.89 MOTOR-Z.2
N$5  (via drill 0.61)
  Top 0.254: IC10.15 70.48,23.11 v69.22,21.84 | v71.5,14.1 73.66,11.94 MOTOR-Z.3
  Bottom 0.254: v69.22,21.84 69.22,17.91 68.33,17.02 68.33,16.26 70.48,14.1 v71.5,14.1
N$6
  Top 0.254: R14.2 LED6.C
N$7
  Top 0.254: R13.2 LED5.C
N$8  (via drill 0.61)
  Top 0.254: v73.91,13.21 75.06,12.06 75.06,8.89 MOTOR-Z.4 | IC10.14 71.75,23.11 68.71,20.07 v68.33,20.07
  Bottom 0.254: v73.91,13.21 v69.85,13.21 67.82,15.24 67.82,17.27 68.33,17.78 v68.33,20.07
N$9  (via drill 0.61)
  Top 0.254: v73.03,21.59 IC10.13 | v69.22,16.64 70.87,14.99 73.53,14.99 76.58,11.94 76.58,8.89 MOTOR-Z.5
  Bottom 0.254: v69.22,16.64 69.22,17.14 73.03,20.95 v73.03,21.59
N$10
  Top 0.254: IC10.1 69.22,19.18 70.74,20.7 73.79,20.7 76.33,23.24 82.3,23.24 85.22,26.16 88.14,26.16 88.9,25.4 IC7.13
N$11  (via drill 0.61)
  Top 0.254: IC10.2 v70.48,16.64 | v80.52,26.67 88.9,26.67 90.17,25.4 IC7.12
  Bottom 0.254: v80.52,26.67 v70.48,16.64
N$12  (via drill 0.61)
  Top 0.254: IC10.3 v71.75,16.64 | v82.68,27.56 89.28,27.56 91.44,25.4 IC7.11
  Bottom 0.254: v82.68,27.56 v71.75,16.64
N$13
  Top 0.254: IC10.4 73.03,19.18 75.44,21.59 90.42,21.59 92.71,23.88 IC7.10
N$14
  Top 0.254: LED6.A 86.36,13.34 90.17,17.14 IC7.3
N$15
  Top 0.254: IC7.2 88.9,16.64 83.57,11.3 81.28,11.3 LED5.A
N$16
  Top 0.254: IC9.16 37.47,21.21 36.2,19.94 36.2,16.13 40.39,11.94 40.39,8.89 MOTOR-Y.2
N$17
  Top 0.254: IC9.15 38.73,21.72 36.7,19.68 36.7,17.14 41.91,11.94 MOTOR-Y.3
N$18  (via drill 0.61)
  Top 0.254: IC9.14 40.01,25.4 39.24,26.16 36.96,26.16 36.58,25.78 v36.58,21.59 | v41.15,14.22 43.31,12.06 43.31,8.89 MOTOR-Y.4
  Bottom 0.254: v36.58,21.59 36.58,18.8 v41.15,14.22
N$19  (via drill 0.61)
  Top 0.254: v41.27,20.45 IC9.13 | v41.27,15.49 44.83,11.94 44.83,8.89 MOTOR-Y.5
  Bottom 0.254: v41.27,15.49 40.64,15.49 39.75,16.38 39.75,18.92 v41.27,20.45
N$20  (via drill 0.61)
  Top 0.254: v55.24,22.61 56.52,23.88 IC6.13 | v40.39,22.1 37.47,19.18 IC9.1
  Bottom 0.254: v55.24,22.61 40.89,22.61 v40.39,22.1
N$21  (via drill 0.61)
  Top 0.254: v40.01,20.45 38.73,19.18 IC9.2 | v56.52,22.61 57.78,23.88 IC6.12
  Bottom 0.254: v40.01,20.45 41.27,21.72 55.63,21.72 v56.52,22.61
N$22  (via drill 0.61)
  Top 0.254: IC9.3 40.01,17.4 v40.64,16.76 | IC6.11 59.05,23.88 v57.78,22.61
  Bottom 0.254: v57.78,22.61 56.39,21.21 52.58,21.21 48.13,16.76 v44.45,16.76 v40.64,16.76
N$23
  Top 0.254: IC9.4 41.27,17.78 43.18,15.88 50.55,15.88 56.39,21.72 58.17,21.72 60.33,23.88 IC6.10
N$24
  Top 0.254: LED4.A 54.61,13.84 57.78,17.02 IC6.3
N$25
  Top 0.254: IC6.2 56.52,16.51 51.31,11.3 49.53,11.3 LED3.A
N$26
  Top 0.254: R10.2 LED2.C
N$27
  Top 0.254: R9.2 LED1.C
N$28
  Top 0.254: IC8.16 5.71,22.99 4.45,21.72 4.45,16.13 8.64,11.94 8.64,8.89 MOTOR-X.2
N$29  (via drill 0.61)
  Top 0.254: IC8.15 6.99,23.5 5.84,22.35 v5.84,21.84 5.84,20.57 4.95,19.68 4.95,17.14 10.16,11.94 MOTOR-X.3 10.16,5.84 v8.89,4.57
N$30  (via drill 0.61)
  Top 0.254: v8.26,21.72 IC8.14 | v8.26,15.37 11.56,12.06 11.56,8.89 MOTOR-X.4
  Bottom 0.254: v8.26,15.37 v8.26,21.72
N$31  (via drill 0.61)
  Top 0.254: v9.14,22.86 9.14,24.26 9.53,24.64 IC8.13 | v11.81,13.21 13.08,11.94 13.08,8.89 MOTOR-X.5
  Bottom 0.254: v9.14,22.86 9.4,22.86 10.29,23.75 11.05,23.75 11.81,22.99 v11.81,13.21
N$32  (via drill 0.61)
  Top 0.254: v7.24,20.7 5.71,19.18 IC8.1 | v24.38,22.61 24.38,24.13 24.77,24.51 IC5.13 | v22.35,24.26 v17.78,24.26
  Bottom 0.254: v7.24,20.7 7.24,22.23 9.27,24.26 v17.78,24.26 | v22.35,24.26 22.73,24.26 v24.38,22.61
N$33  (via drill 0.61)
  Top 0.254: IC8.2 6.99,19.18 v10.67,22.86 14.73,22.86 17.4,25.53 v22.35,25.53 | IC5.12 26.04,25.4 v24.89,26.54
  Bottom 0.254: v24.89,26.54 23.37,26.54 v22.35,25.53
N$34  (via drill 0.61)
  Top 0.254: v25.65,22.48 25.91,22.48 27.3,23.88 IC5.11 27.3,26.04 v23.37,29.97 | v10.67,21.59 8.26,19.18 IC8.3
  Bottom 0.254: v23.37,29.97 23.37,28.57 12.7,17.91 12.7,12.83 12.19,12.32 11.43,12.32 10.67,13.08 v10.67,21.59
N$35
  Top 0.254: IC8.4 9.53,19.18 11.94,21.59 26.29,21.59 28.57,23.88 IC5.10
N$36
  Top 0.254: IC5.3 26.04,16.89 24.64,15.49 24.64,12.45 23.5,11.3 22.86,11.3 LED2.A
N$37  (via drill 0.61)
  Top 0.254: LED1.A 17.78,11.3 v19.18,11.3 19.18,16 v22.35,19.18 | v24.51,16.64 24.51,18.29 24.77,18.54 IC5.2
  Bottom 0.254: v22.35,19.18 24.51,17.02 v24.51,16.64
N$38
  Top 0.254: D1.C 85.09,48.01 86.49,48.01 F1.1
POWERIN  (via drill 0.61)
  Top 0.762: v2.16,57.15 2.79,57.78 6.35,57.78 OUT-A.2 | v2.16,50.04 2.16,48.51 2.92,47.75 | 2.92,47.75 6.35,47.75 OUT-B.2 | 2.92,47.75 2.16,46.99 2.16,40.01 5.46,36.7 5.59,36.7 6.1,36.2 C3.1 6.35,35.81 6.99,35.81 9.02,33.78 IC2.1 9.14,34.16 13.08,38.1 14.61,38.1 15.37,38.86 35.05,38.86 37.85,36.07 C4.1 38.1,35.81 41.53,35.81 v41.78,35.56 41.78,34.67 40.89,33.78 IC3.1 | 90.17,49.66 90.17,56.64 93.22,59.69 J1.VIN0 | 90.17,49.66 F1.2 | 70.48,35.81 69.85,35.81 C5.1 69.6,36.2 65.91,36.2 57.28,44.83 IC1.1 57.28,45.21 55.5,46.99 54.86,46.99 C1.1 54.61,47.24 54.36,46.99 v53.21,46.99 | 70.48,35.81 72.52,33.78 IC4.1 | 90.17,49.66 80.77,49.66 71.12,40.01 71.12,36.45 70.48,35.81
  Bottom 0.762: v2.16,50.04 v2.16,57.15 | v53.21,46.99 v41.78,35.56
RESET1  (via drill 0.61)
  Top 0.254: v84.2,28.96 84.2,34.29 R8.1 | IC7.4 91.44,15.24 91.5,15.18 | ISP-Z.5 91.5,15.18 | v84.96,10.79 85.6,10.16 87.12,10.16 87.63,10.67 87.63,12.7 90.04,15.11 91.44,15.11 91.5,15.18
  Bottom 0.254: v84.2,28.96 84.2,11.56 v84.96,10.79
RESET2  (via drill 0.61)
  Top 0.254: v52.45,29.21 52.45,30.35 55.37,33.27 55.37,35.31 53.85,36.83 52.58,36.83 52.07,36.32 52.07,34.54 52.32,34.29 R7.1 | IC6.4 59.05,15.88 ISP-Y.5
  Bottom 0.254: v52.45,29.21 61.09,20.57 61.09,16.51 62.23,15.37 ISP-Y.5
RESET3  (via drill 0.61)
  Top 0.254: R6.1 20.7,34.29 v20.7,32.64 25.15,32.64 32,25.78 32,21.46 30.73,20.19 28.19,20.19 27.3,19.3 IC5.4 27.3,15.88 ISP-X.5
VLOW  (via drill 0.61)
  Top 0.254: v20.95,57.02 19.68,55.75 U1.2 | R4.2 17.78,60.71 20.32,60.71 R2.2 20.32,60.58 20.57,60.58 21.72,59.44 v21.97,59.44 32.38,59.44 36.58,63.63 39.24,63.63 40.01,62.87 40.01,59.69 INPUT.2
  Bottom 0.254: v20.95,57.02 20.95,58.42 v21.97,59.44

### Text on the board
tPlace: FR293 / Rev. G | X | Y | Z